# EAGLE design FW2-02-DingDongDoorbell (EAGLE 6.5.0)
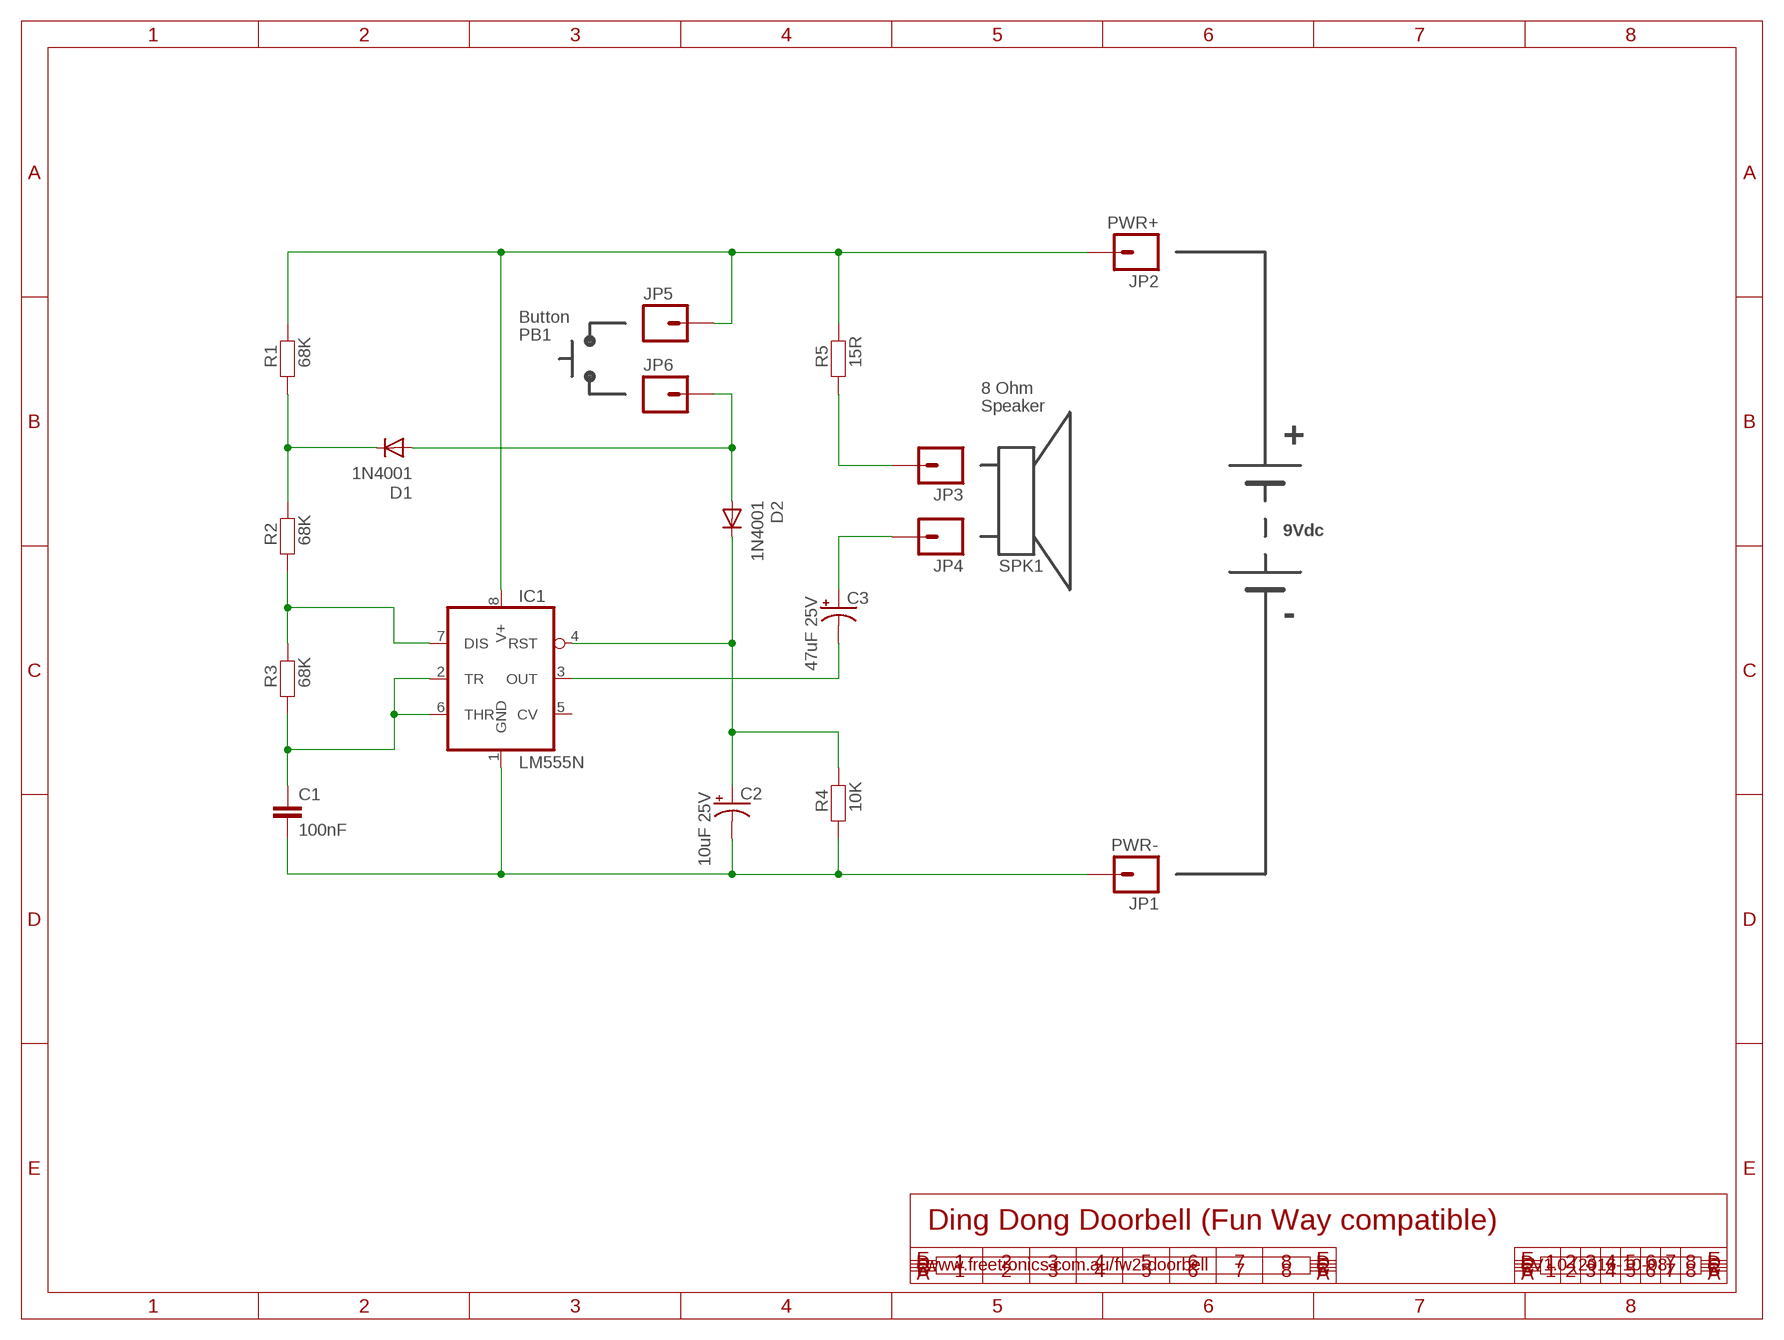
[diagram p0: schematic, sheet 1]

## Parts
C1  100nF  CAPPTH  [CAP-PTH-SMALL]
C2  10uF 25V  CAP_POLPTH2  [CPOL-RADIAL-10UF-25V]
C3  47uF 25V  CAP_POLPTH2  [CPOL-RADIAL-10UF-25V]
D1  1N4001  DIODEPTH  [DIODE-1N4001]
D2  1N4001  DIODEPTH  [DIODE-1N4001]
IC1  LM555N  [DIL08]
JP1  PWR-  M01PTH  [1X01]
JP2  PWR+  M01PTH  [1X01]
JP3  SPKR+  M01PTH  [1X01]
JP4  SPKR-  M01PTH  [1X01]
JP5  PWR-  M01PTH  [1X01]
JP6  PWR-  M01PTH  [1X01]
R1  68K  FREETRONICS_RESISTORPTH2  [FREETRONICS_AXIAL-0.4]
R2  68K  FREETRONICS_RESISTORPTH2  [FREETRONICS_AXIAL-0.4]
R3  68K  FREETRONICS_RESISTORPTH2  [FREETRONICS_AXIAL-0.4]
R4  10K  FREETRONICS_RESISTORPTH2  [FREETRONICS_AXIAL-0.4]
R5  15R  FREETRONICS_RESISTORPTH2  [FREETRONICS_AXIAL-0.4]

## Nets
N$1: D1.C R1.P$1 R2.P$2
N$2: IC1.7(DIS) R2.P$1 R3.P$2
N$3: D1.A D2.A JP6.1
N$4: IC1.8(V+) JP2.1 JP5.1 R1.P$2 R5.P$2
N$5: JP3.1 R5.P$1
N$6: C3.1(+) JP4.1
N$7: C3.2(-) IC1.3(OUT)
N$8: C2.1(+) D2.C IC1.4(RST) R4.P$2
N$10: C1.2 C2.2(-) IC1.1(GND) JP1.1 R4.P$1
N$12: C1.1 IC1.2(TR) IC1.6(THR) R3.P$1
Unconnected: IC1.5(CV)

## Notes on the sheet
- Button
- PB1
- 8 Ohm
- Speaker
- +
- 9Vdc
- SPK1
- -
- Ding Dong Doorbell (Fun Way compatible)
- www.freetronics.com.au/fw2-doorbell | V1.0 (2016-10-08)

## Library data of the parts
C1 = freetronics-2:CAP: Capacitor Standard 0603 ceramic capacitor, and 0.1" leaded capacitor.
C2 C3 = freetronics-jon.1:CAP_POL: Capacitor Polarized These are standard SMD and PTH capacitors. Normally 10uF, 47uF, and 100uF in electrolytic and tantalum varieties. Always verify the external diameter of the through hole cap, it varies with capacity, voltage, and manufacturer. The EIA devices should be standard.
D1 D2 = freetronics-2:DIODE: Diode These are standard reverse protection diodes and small signal diodes. SMA package can handle up to about 1A. SOD-323 can handle about 200mA. What the SOD-323 package when ordering, there are some mfgs out there that are 5-pin packages.
IC1 = freetronics-jon:*555: TIMER
JP1-JP6 = freetronics-master-v1.1:M01: Header 1 Standard 1-pin 0.1" header. Use with straight break away headers (SKU : PRT-00116), right angle break away headers (PRT-00553), swiss pins (PRT-00743), machine pins (PRT-00117), and female headers (PRT-00115).
R1-R5 = freetronics:FREETRONICS_RESISTOR: Resistor Basic schematic elements and footprints for 0603, 1206, and PTH 1/10th watt (small) resistors.

## Board
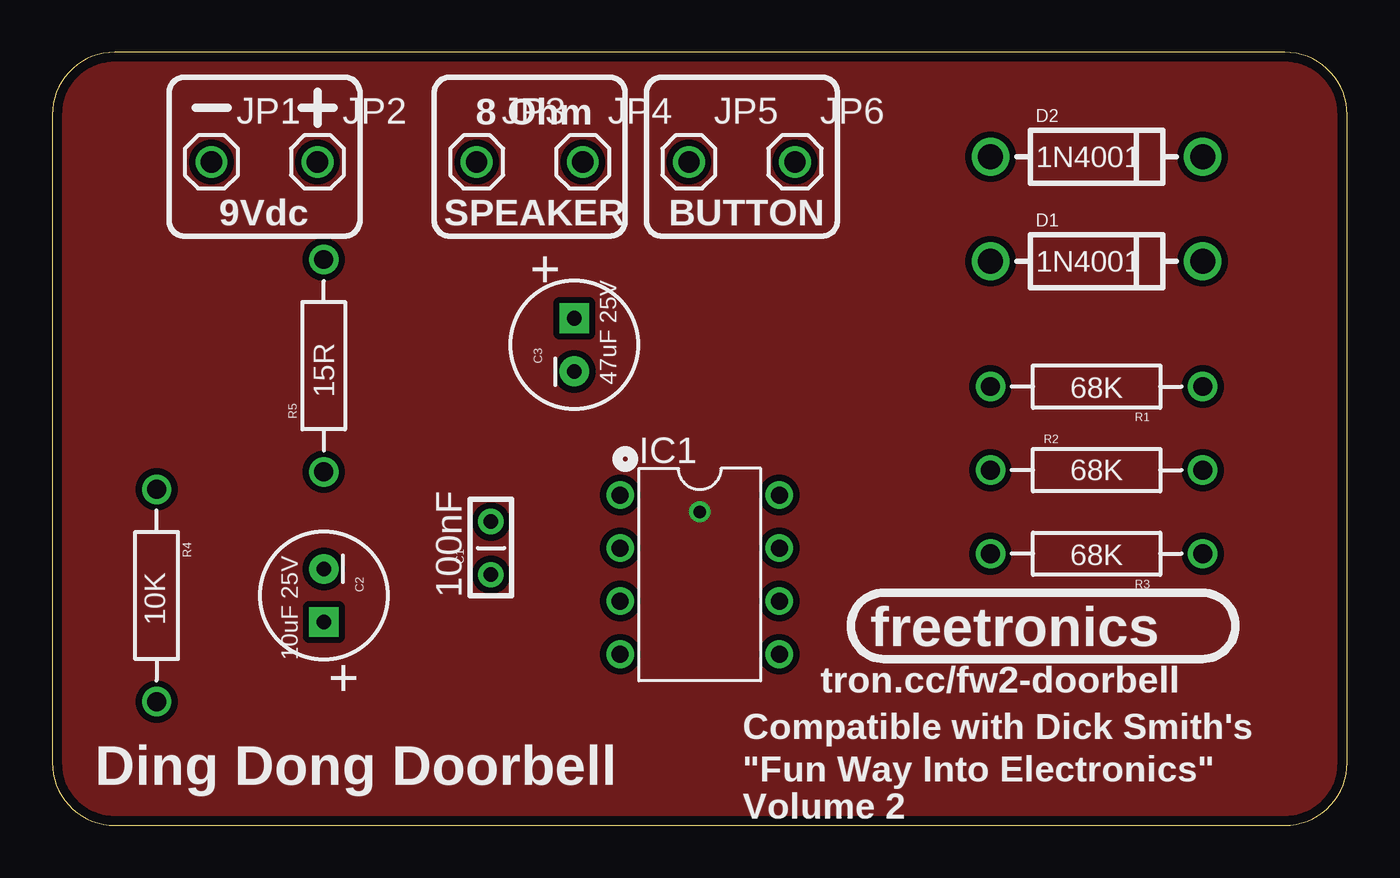
[diagram p1: board, top side]
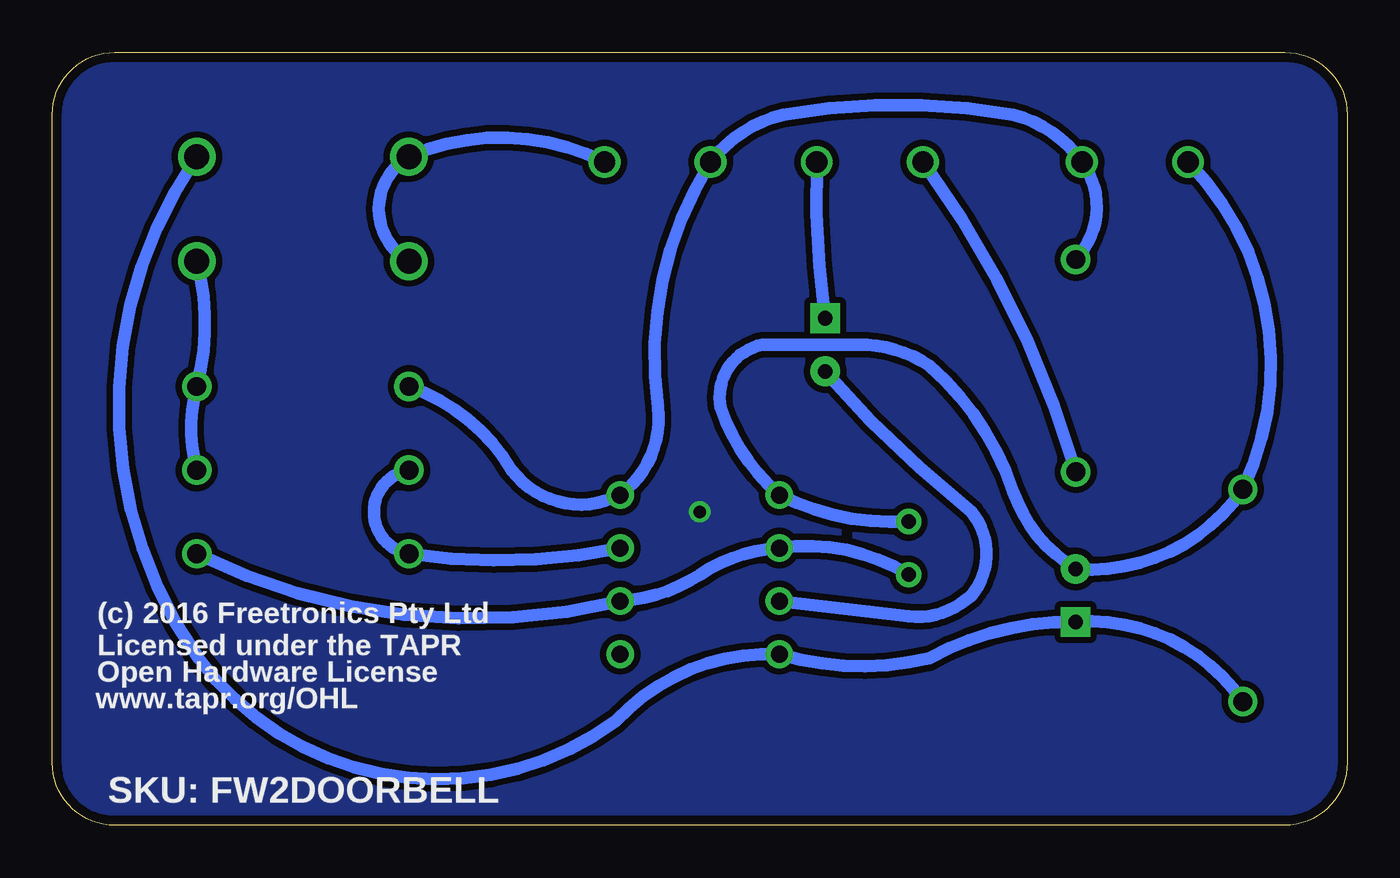
[diagram p2: board, bottom side, seen from below]

Size 62 x 37 mm. Coordinates in mm from the lower left corner, seen from the top.
Outline: 0,3 arc90 3,0 59,0 arc90 62,3 62,34 arc90 59,37 3,37 arc90 0,34 0,3
Copper layers (1*16): Top 0.035mm / dielectric 1.5mm / Bottom 0.035mm
Design rules "default *": minimum track width 10mil, minimum drill 24mil, track to track 12mil, track to pad 12mil, pad to pad 12mil, via to via 12mil, smd to smd 8mil, copper to edge 18mil, drill to drill 8mil, minimum pad ring 10mil, minimum via ring 8mil, stop-mask expansion 4mil, vias tented up to drill 25mil, thermal gap 10mil

### Footprints (pad centres in the part's own frame; a part is rotated, then mirrored left to right if it is on the bottom)
CAP-PTH-SMALL = drill 0.7: 1 0,0; 2 2.54,0
CPOL-RADIAL-10UF-25V = drill 0.7 pad 1.422 square: 1 1.27,0 | drill 0.7 pad 1.422: 2 -1.27,0
DIODE-1N4001 = drill 1.2: A -5.08,0; C 5.08,0
DIL08 = drill 0.813 pad 1.27: 1 -3.81,-3.81; 2 -1.27,-3.81; 3 1.27,-3.81; 4 3.81,-3.81; 5 3.81,3.81; 6 1.27,3.81; 7 -1.27,3.81; 8 -3.81,3.81
1X01 = drill 1.016: 1 0,0
FREETRONICS_AXIAL-0.4 = drill 0.9: P$1 -5.08,0; P$2 5.08,0

### Placement (x,y rotation side)
C1  21,12 90 top
C2  13,11 270 top
C3  25,23 90 top
D1  50,27 0 top
D2  50,32 0 top
IC1  31,12 270 top
JP1  7.62,31.75 0 top
JP2  12.7,31.75 0 top
JP3  20.32,31.75 0 top
JP4  25.4,31.75 0 top
JP5  30.48,31.75 0 top
JP6  35.56,31.75 0 top
R1  50,21 180 top
R2  50,17 0 top
R3  50,13 180 top
R4  5,11 270 top
R5  13,22 90 top

### Tracks (layer width: path | path; a pad name or v marks a point on that pad's centre or on a via)
GND  (via drill 0.6)
  other vias: 31,15
  pour Bottom: 0,34 arc-90 3,37 59,37 arc-90 62,34 62,3 arc-90 59,0 3,0 arc-90 0,3
  pour Top: 0,34 arc-90 3,37 59,37 arc-90 62,34 62,3 arc-90 59,0 3,0 arc-90 0,3
N$1
  Bottom 0.61: R2.P$2 arc30 R1.P$1 arc-30 D1.C
N$2
  Bottom 0.61: R2.P$1 arc-160 R3.P$2 arc-20 IC1.7
N$3
  Bottom 0.61: D1.A arc120 D2.A arc50 JP6.1
N$4
  Bottom 0.61: R5.P$2 arc-80 JP2.1 arc-40 16,34 arc-20 27,34 arc-40 JP5.1 arc-40 33,20 arc60 IC1.8 arc80 40,17 arc-40 R1.P$2
N$5
  Bottom 0.61: R5.P$1 arc-20 JP3.1
N$6
  Bottom 0.61: C3.1 arc10 JP4.1
N$7
  Bottom 0.61: IC1.3 21,10 arc-50 18,11 arc-80 18,15 arc10 C3.2
N$8
  Bottom 0.61: R4.P$2 arc-60 C2.1 arc-30 20,8 arc30 IC1.4 arc-50 35,5 arc90 55,8 arc70 D2.C
N$10
  Bottom 0.61: JP1.1 arc70 R4.P$1 arc60 C2.2 arc40 16,16 arc-30 20,22 arc-30 23,23 28,23 arc-90 30,20 arc-30 IC1.1 arc-30 C1.2
N$12
  Bottom 0.61: R3.P$1 arc-40 IC1.6 arc-30 31,12 arc30 IC1.2 arc40 C1.1

### Text on the board
tPlace: 8 Ohm | 9Vdc | SPEAKER | BUTTON | + | 100nF | freetronics | + | tron.cc/fw2-doorbell | Compatible with Dick Smith's | Ding Dong Doorbell | "Fun Way Into Electronics" | Volume 2
bPlace: (c) 2016 Freetronics Pty Ltd | Licensed under the TAPR | Open Hardware License | www.tapr.org/OHL | SKU: FW2DOORBELL